# Altium schematic sheet signal_conditioning_circuit.SchDoc: Piezoelectric sensors conditioning circuit
size A4; SheetNumber: 16; SheetTotal: 20; TitleBig: Piezoelectric sensors conditioning circuit; Desc_line1: Two analog signals come from two piezoelectric sensors nailed into a tree or trunk. The way piezos work force us to; Desc_line2: use this circuit to convert charge into voltage. The piezo sensors used generated upto -100 V peak, so it needs clipping
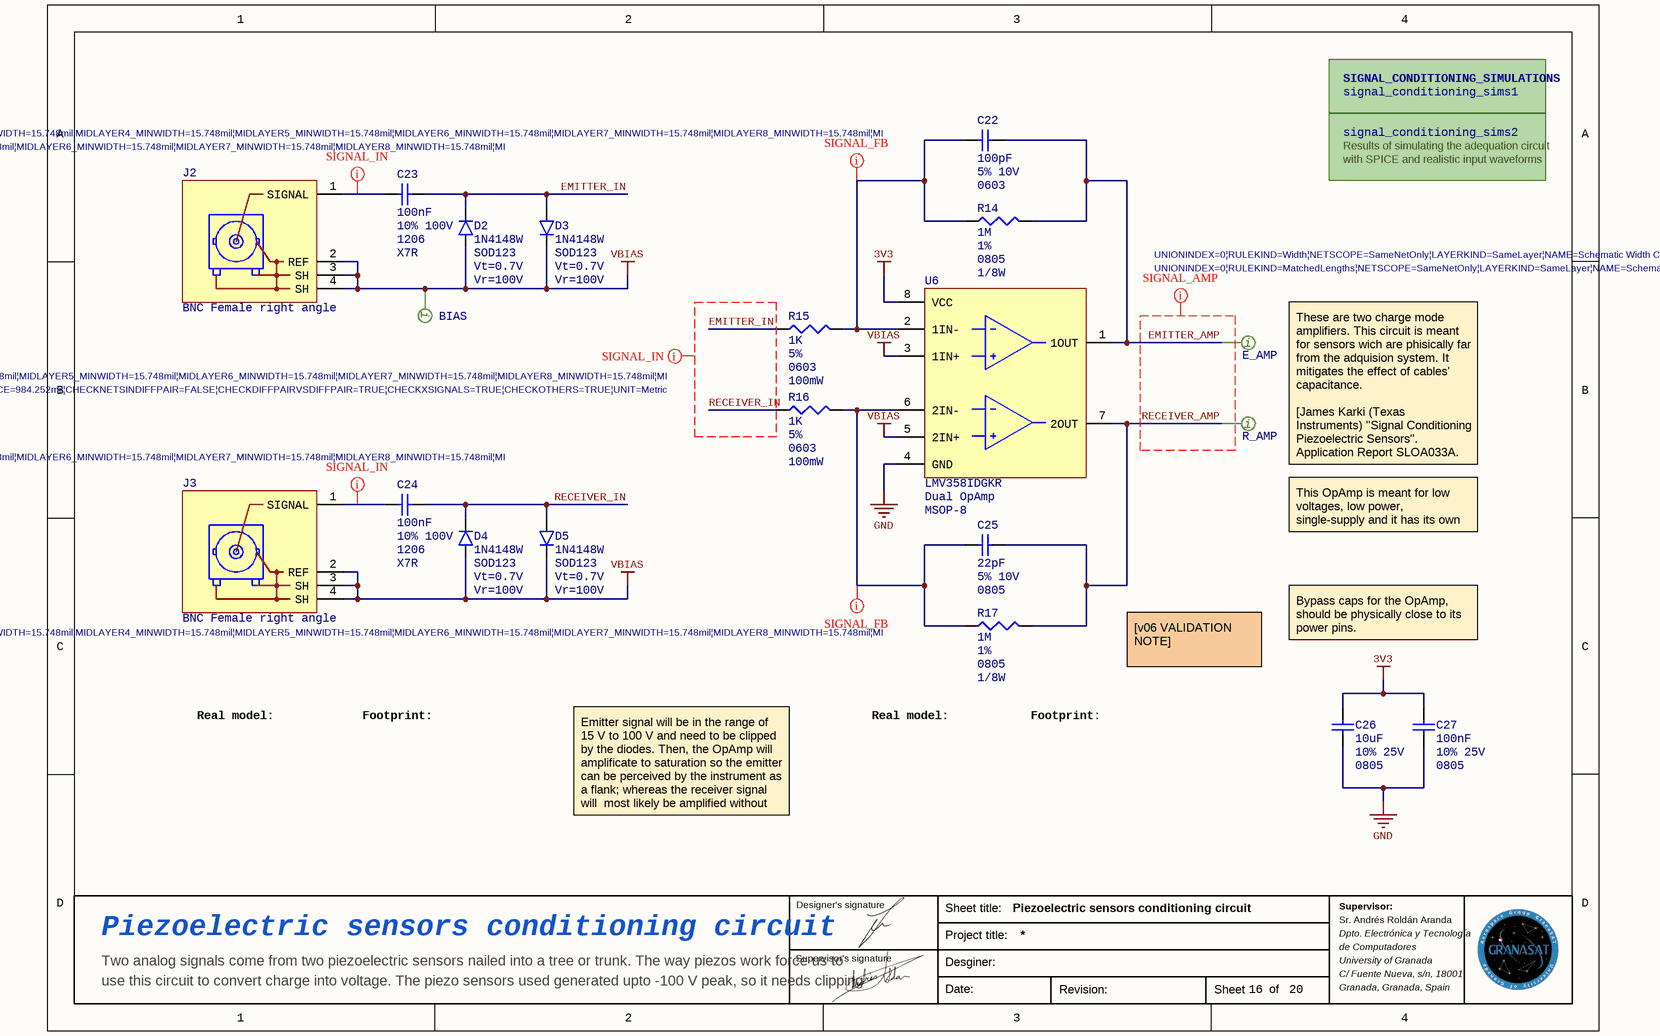
[diagram p0: signal_conditioning_circuit.SchDoc]

## Parts
BIAS  Test Point Pad dual sided  [TEST POINT PAD]  (value not drawn)  (no BOM)
C22  value 100pF  Tolerance: 5% 10V  PackageDescription: 0603  [CAP 0603_1608]  (hidden comment: Cap_cer_0603_100pF_5%)
C23  value 100nF  Tolerance: 10% 100V  PackageDescription: 1206  Type: X7R  [CAP 1206_3216]  (hidden comment: Cap_cer_0805)
C24  value 100nF  Tolerance: 10% 100V  PackageDescription: 1206  Type: X7R  [CAP 1206_3216]  (hidden comment: Cap_cer_0805)
C25  value 22pF  Tolerance: 5% 10V  PackageDescription: 0805  [CAP 0603_1608]  (hidden comment: Cap_cer_0603_22pF_5%)
C26  value 10uF  Tolerance: 10% 25V  PackageDescription: 0805  [CAP 0805_2012]  (hidden comment: Cap_cer_0805)
C27  value 100nF  Tolerance: 10% 25V  PackageDescription: 0805  [CAP 0805_2012]  (hidden comment: Cap_cer_0805)
D2  Part: 1N4148W  PackageDescription: SOD123  ForwardVoltage: Vt=0.7V  ReverseVoltage: Vr=100V  [SOD123F 1N4148W]  (hidden comment: Diode 1N4148W)
D3  Part: 1N4148W  PackageDescription: SOD123  ForwardVoltage: Vt=0.7V  ReverseVoltage: Vr=100V  [SOD123F 1N4148W]  (hidden comment: Diode 1N4148W)
D4  Part: 1N4148W  PackageDescription: SOD123  ForwardVoltage: Vt=0.7V  ReverseVoltage: Vr=100V  [SOD123F 1N4148W]  (hidden comment: Diode 1N4148W)
D5  Part: 1N4148W  PackageDescription: SOD123  ForwardVoltage: Vt=0.7V  ReverseVoltage: Vr=100V  [SOD123F 1N4148W]  (hidden comment: Diode 1N4148W)
E_AMP  Test Point Pad dual sided  [TEST POINT PAD]  (value not drawn)  (no BOM)
J2  Type: BNC Female right angle  [BNC RIGHT ANGLE]  (hidden comment: BNC-Female)
J3  Type: BNC Female right angle  [BNC RIGHT ANGLE]  (hidden comment: BNC-Female)
R14  value 1M  Tolerance: 1%  PackageDescription: 0805  PowerDisipated: 1/8W  [RES 0805_2012]  (hidden comment: Yageo-RC0805FR-072ML)
R15  value 1K  Tolerance: 5%  PackageDescription: 0603  PowerDisipated: 100mW  [RES 0603_1608]  (hidden comment: Res_0603_1K_5%_100mW)
R16  value 1K  Tolerance: 5%  PackageDescription: 0603  PowerDisipated: 100mW  [RES 0603_1608]  (hidden comment: Res_0603_1K_5%_100mW)
R17  value 1M  Tolerance: 1%  PackageDescription: 0805  PowerDisipated: 1/8W  [RES 0805_2012]  (hidden comment: Yageo-RC0805FR-072ML)
R_AMP  Test Point Pad dual sided  [TEST POINT PAD]  (value not drawn)  (no BOM)
U6  Part: LMV358IDGKR  Type: Dual OpAmp  PackageDescription: MSOP-8  [VSSOP-8 DGK (MSOP-8) LMV358]  (hidden comment: IC LMV358DGKR OpAmp)

## Sub-sheets
Designator = signal_conditioning_sims2: no entries
SIGNAL_CONDITIONING_SIMULATIONS = signal_conditioning_sims1: no entries

## Nets
3V3: C26.2 C27.2 U6.8(VCC)
GND: C26.1 C27.1 U6.4(GND)
VBIAS: BIAS.1 D2.1 D3.2 D4.1 D5.2 J2.2(REF) J2.3(SH) J2.4(SH) J3.2(REF) J3.3(SH) J3.4(SH) U6.3(1IN+) U6.5(2IN+)
EMITTER_AMP: C22.2 E_AMP.1 R14.2 U6.1(1OUT)
EMITTER_IN: C23.2 D2.2 D3.1 R15.1
RECEIVER_AMP: C25.2 R17.2 R_AMP.1 U6.7(2OUT)
RECEIVER_IN: C24.2 D4.2 D5.1 R16.1
NetC22_1: C22.1 R14.1 R15.2 U6.2(1IN-)
NetC23_1: C23.1 J2.1(SIGNAL)
NetC24_1: C24.1 J3.1(SIGNAL)
NetC25_1: C25.1 R16.2 R17.1 U6.6(2IN-)

## Layout directives
net class SIGNAL_IN; rule Matched Net Lengths [Tolerance = 25mm]; rule Width Constraint [Pref Width = 0.8mm    Min Width = 0.35mm    Max Width = 0.8mm]: EMITTER_IN, RECEIVER_IN
net class SIGNAL_AMP; rule Matched Net Lengths [Tolerance = 25mm]; rule Width Constraint [Pref Width = 0.8mm    Min Width = 0.35mm    Max Width = 0.8mm]: EMITTER_AMP, RECEIVER_AMP
net class SIGNAL_FB; rule Width Constraint [Pref Width = 0.8mm    Min Width = 0.35mm    Max Width = 0.8mm]: NetC22_1, NetC25_1
net class SIGNAL_IN; rule Width Constraint [Pref Width = 0.8mm    Min Width = 0.35mm    Max Width = 0.8mm]: NetC23_1, NetC24_1

## Notes on the sheet
- Results of simulating the adequation circuit
- with SPICE and realistic input waveforms
- These are two charge mode amplifiers. This circuit is meant for sensors wich are phisically far from the adquision system. It mitigates the effect of cables' capacitance.
  [James Karki (Texas Instruments) "Signal Conditioning Piezoelectric Sensors". Application Report SLOA033A. September 2000]
- This OpAmp is meant for low voltages, low power, single-supply and it has its own ESD protection.
- Bypass caps for the OpAmp, should be physically close to its power pins.
- Real model:
- Footprint:
- [v06 VALIDATION NOTE]
  UNTESTED
- Emitter signal will be in the range of 15 V to 100 V and need to be clipped by the diodes. Then, the OpAmp will amplificate to saturation so the emitter can be perceived by the instrument as a flank; whereas the receiver signal will  most likely be amplified without any clipping.
- Designer's signature
- Sheet title:
- Sr. Andrés Roldán Aranda
- Supervisor:
- Supervisor's signature
- Project title:
- Desginer:
- Dpto. Electrónica y Tecnología
- de Computadores
- University of Granada
- C/ Fuente Nueva, s/n, 18001
- Granada, Granada, Spain
- Date:
- Revision:
- Sheet
- of
- (in symbol Test Point Pad dual sided) i

## Library data of the parts
BIAS E_AMP R_AMP = Test Point Pad dual sided: Test point - PCB Pad dual sided
C22 = Cap_cer_0603_100pF_5%: Ceramic cap size 0805
C23 C24 = Cap_cer_1206_100nF_100V_10%: Ceramic cap size 1206 C1206C104K1RACTU
C25 = Cap_cer_0603_22pF_5%: Ceramic cap size 0805
C26 = Cap_cer_0805_10uF_10%: Ceramic cap size 0805; FabGroup: Signal conditioning; FabOrder: 13
C27 = Cap_cer_0805_100nF_10%: Ceramic cap size 0805; FabGroup: Signal conditioning; FabOrder: 13
D2-D5 = Diode 1N4148W: SURFACE MOUNT FAST SWITCHING DIODE; Type: Rectifier, General purpose; FabGroup: Signal conditioning; FabOrder: 13
J2 J3 = CON BNC Female Socket: BNC coaxial female connector
R14 R17 = Res_0805_1M_1%: Res size 0805 SMD mounting, low power. / Yageo-RC0805FR-071ML
R15 R16 = Res_0603_1K_5%_100mW: Res size 0603 SMD mounting, low power
U6 = IC LMV358DGKR OpAmp: LMV358IDGKR Dual OpAmp; low voltage rail to rail opamp; 2.7V to 5V Vss; ESD protection; MSOP-8 Package.